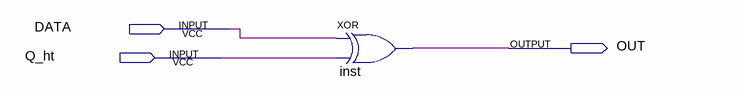
[diagram p0: schematic sheet]
// Quartus schematic BT_THEM.bdf as structural Verilog: 1 symbols, 3 pins
module BT_THEM (
  input  DATA,
  input  Q_ht,
  output OUT
);

  xor inst (OUT, DATA, Q_ht);
endmodule
